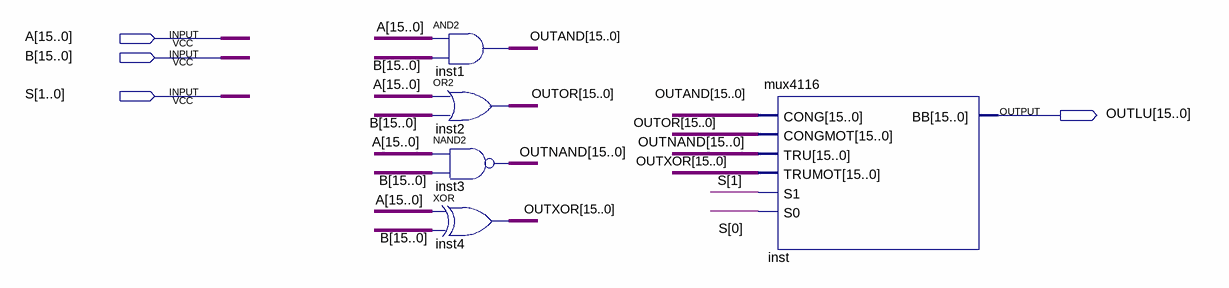
[diagram p0: schematic sheet]
// Quartus schematic LU.bdf as structural Verilog: 5 symbols, 4 pins
module LU (
  input  [15:0] A,
  input  [15:0] B,
  input  [1:0] S,
  output [15:0] OUTLU
);

  wire [15:0] OUTAND, OUTNAND, OUTOR, OUTXOR;

  assign OUTAND = A & B;  // AND2 inst1, 16 bits wide
  assign OUTOR = A | B;  // OR2 inst2, 16 bits wide
  assign OUTNAND = ~(A & B);  // NAND2 inst3, 16 bits wide
  assign OUTXOR = A ^ B;  // XOR inst4, 16 bits wide
  mux4116 inst (.CONG(OUTAND), .CONGMOT(OUTOR), .TRU(OUTNAND), .TRUMOT(OUTXOR), .S1(S[1]), .S0(S[0]), .BB(OUTLU));
endmodule
